# Altium schematic sheet LED_Driver.SchDoc
size A4; SheetNumber: 4; SheetTotal: 6
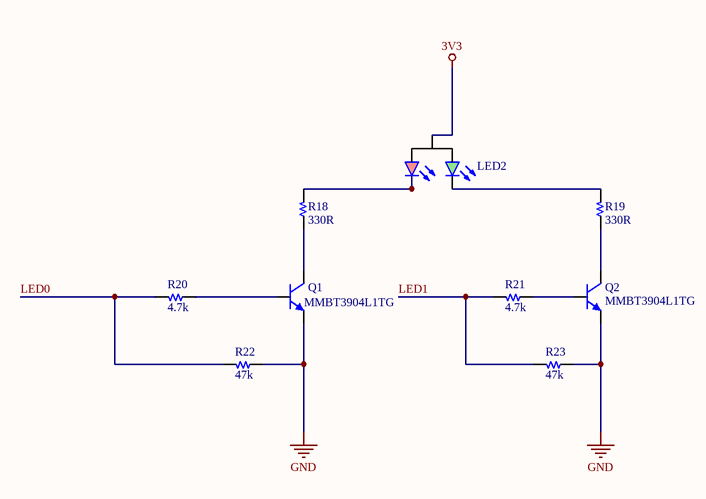
[diagram p0: LED_Driver.SchDoc]

## Parts
LED2  Led 3pin 2color  [LED 3PIN 2COLOR 5MM]  (value not drawn)
Q1  MMBT3904L1TG  [SOT-23]
Q2  MMBT3904L1TG  [SOT-23]
R18  330R  [R 0805]
R19  330R  [R 0805]
R20  4.7k  [R 0805]
R21  4.7k  [R 0805]
R22  47k  [R 0805]
R23  47k  [R 0805]

## Nets
3V3: LED2.2(A)
GND: Q1.2(E) Q2.2(E) R22.1 R23.1
LED0: R20.2 R22.2
LED1: R21.2 R23.2
NetLED2_1: LED2.1(RK) R18.2
NetLED2_3: LED2.3(YK) R19.2
NetQ1_1: Q1.1(B) R20.1
NetQ1_3: Q1.3(C) R18.1
NetQ2_1: Q2.1(B) R21.1
NetQ2_3: Q2.3(C) R19.1

## Library data of the parts
LED2 = Led 3pin 2color: Typical LED 3-pin 2-color
Q1 Q2 = Transistor NPN: NPN Bipolar Transistor
R18-R23 = Resistor